# EAGLE schematic car (EAGLE 7.2.0)
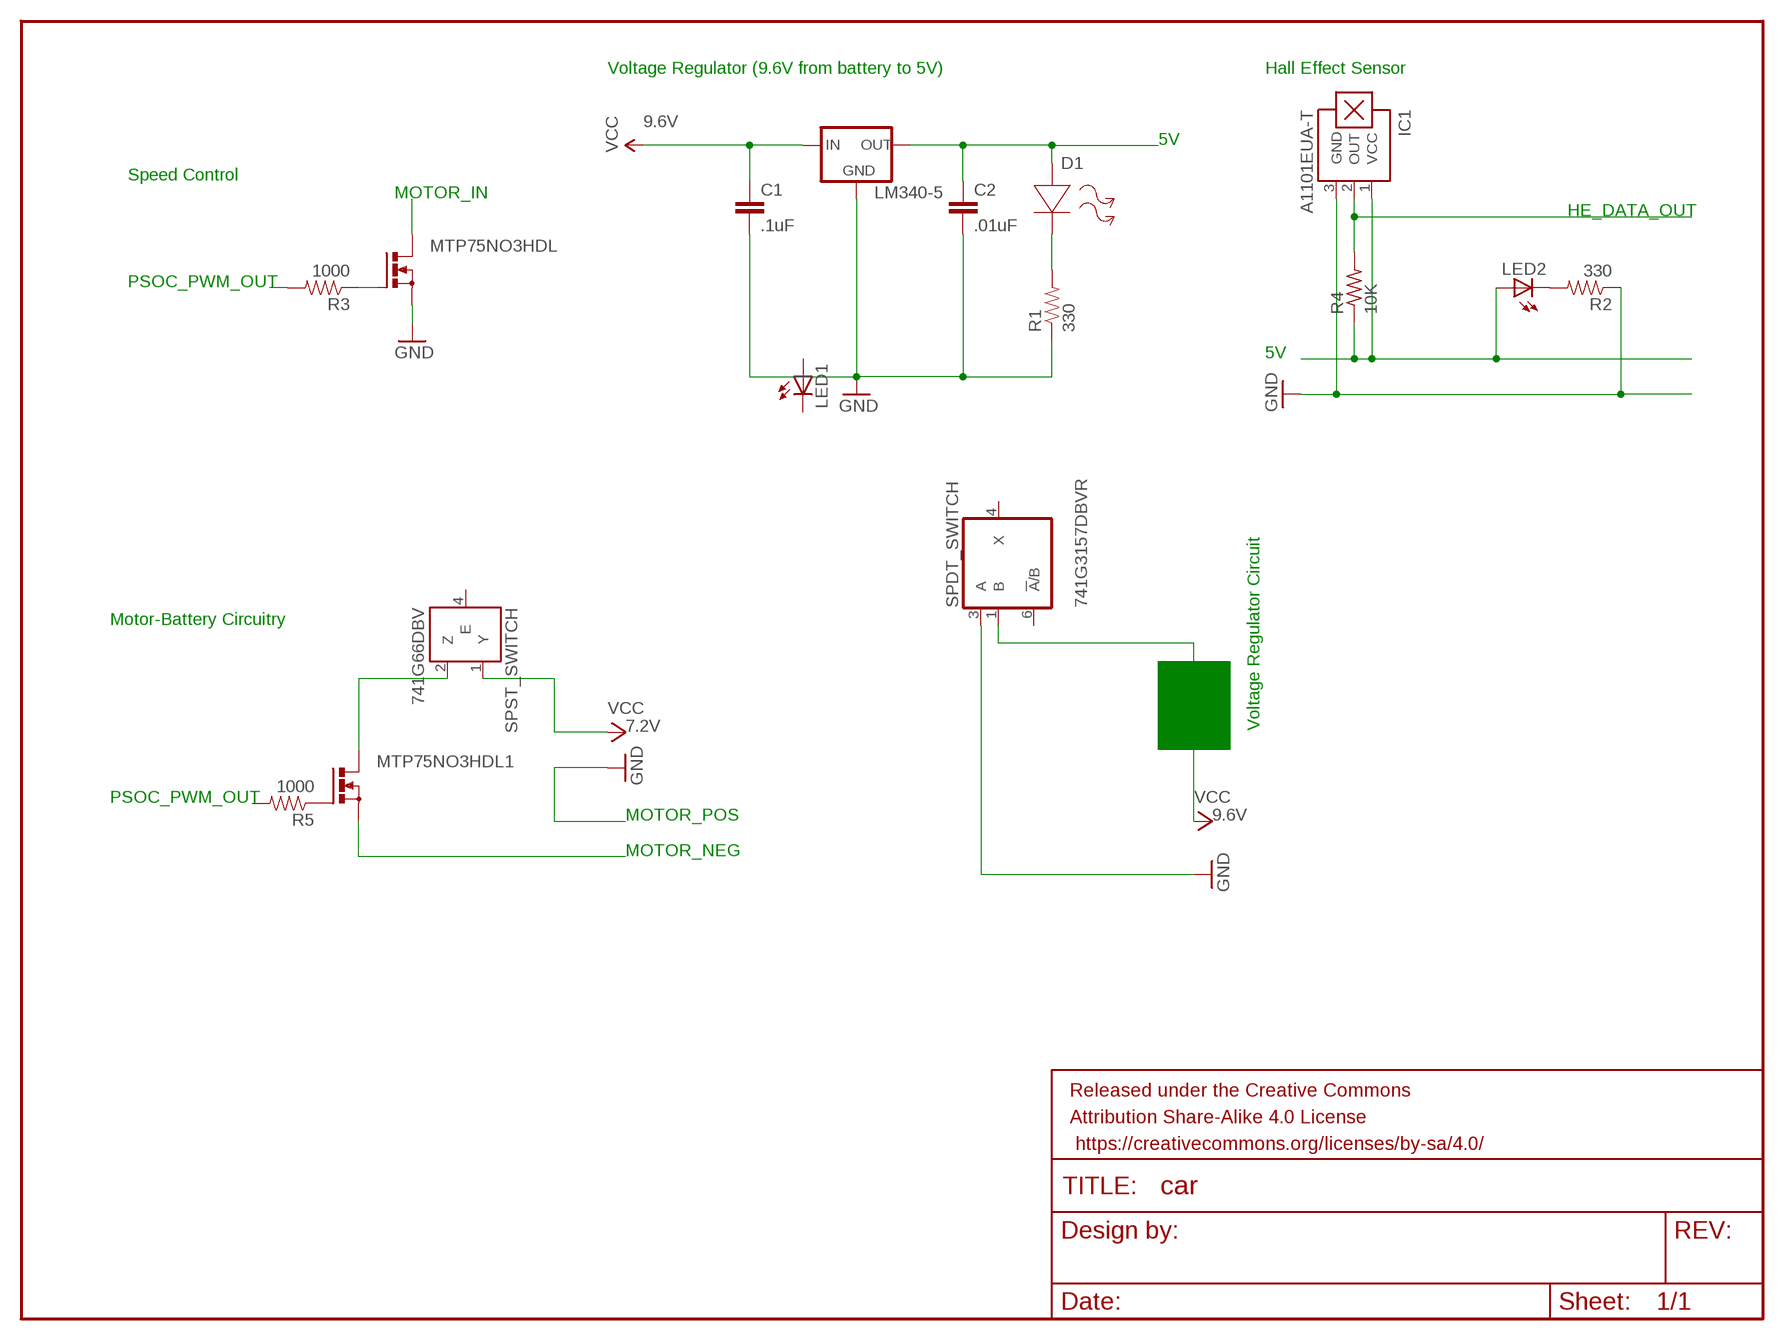
[diagram p0: schematic, sheet 1]

## Parts
C1  .1uF  CAP0402-CAP  [0402-CAP]
C2  .01uF  CAP0402-CAP  [0402-CAP]
D1  LED  [R0805]
FRAME1  FRAME-LETTER  [CREATIVE_COMMONS]
IC1  A1101EUA-T  A1301LH  [SOT23-W]
LED1  LED_E  [LED_1206]
LED2  LED_E  [LED_1206]
LM340-5  V_REG_78XX-TO-220  [TO-220-ALT]
MTP75NO3HDL  PMOSFET_NTO220BH  [TO220BH]
MTP75NO3HDL1  PMOSFET_NTO220BH  [TO220BH]
R1  330  RESISTOR0402-RES  [0402-RES]
R2  330  RESISTOR0402-RES  [0402-RES]
R3  1000  RESISTOR0402-RES  [0402-RES]
R4  10K  R-US_0204/2V  [0204V]
R5  1000  RESISTOR0402-RES  [0402-RES]
SPDT_SWITCH  741G3157DBVR  [DBV_R-PDSO-G6]
SPST_SWITCH  741G66DBV  [SOT23-5]

## Nets
GND: C1.2 C2.2 IC1.3(GND) LM340-5.GND MTP75NO3HDL.S R1.1 R2.1 SPDT_SWITCH.3(A)
N$1: IC1.1(VCC) LED2.A R4.1
N$2: D1.2(-) R1.2
N$3: IC1.2(OUT) R4.2
N$4: C2.1 D1.1(+) LM340-5.OUT
N$5: MTP75NO3HDL.D
N$6: LED2.C R2.2
N$7: MTP75NO3HDL.G R3.1
N$8: R3.2
N$9: MTP75NO3HDL1.D SPST_SWITCH.2(Z)
N$10: MTP75NO3HDL1.S
N$11: MTP75NO3HDL1.G R5.1
N$12: SPDT_SWITCH.1(B)
VCC: C1.1 LM340-5.IN SPST_SWITCH.1(Y)
Unconnected: LED1.A LED1.C R5.2 SPDT_SWITCH.4(X) SPDT_SWITCH.6(!A!/B) SPST_SWITCH.4(E)

## Notes on the sheet
- Voltage Regulator (9.6V from battery to 5V) | Hall Effect Sensor
- 5V
- Speed Control
- MOTOR_IN
- HE_DATA_OUT
- PSOC_PWM_OUT
- 5V
- Voltage Regulator Circuit
- Motor-Battery Circuitry
- PSOC_PWM_OUT
- MOTOR_POS
- MOTOR_NEG

## Power pins joined to a net without a drawn wire
GND: SPDT_SWITCH.2(GND) SPST_SWITCH.3(GND)
VCC: SPDT_SWITCH.5(VCC) SPST_SWITCH.5(VCC)

## Library data of the parts
C1 C2 = SparkFun-Capacitors:CAP: Capacitor Standard 0603 ceramic capacitor, and 0.1" leaded capacitor.
D1 = sym:LED: Light Emitting Diode; SPICEMODEL: NONE; SPICETYPE: diode
FRAME1 = SparkFun-Aesthetics:FRAME-LETTER: Schematic Frame Standard 8.5x11 US Letter frame; DESIGNER: NAME; VERSION: v01
IC1 = allegro:A13*?: Linear Hall Effect Sensor ICs Continuous-Time Ratiometric High-Temperature Operation Programmable Linear with Analog Output A1302 -Replacement- UGN3503 Source: http://www.allegromicro.com/en/Products/Part_Numbers/1301/1301.pdf http://www.allegromicro.com/en/Products/Part_Numbers/1321/1321.pdf http://www.allegromicro.com/en/Products/Part_Numbers/1381/1381.pdf; MF: ALLEGRO MICROSYSTEMS, INC.; MPN: A1301ELHLT-T; OC_FARNELL: 1198084; OC_NEWARK: 31K6634
LED1 LED2 = eagle-ltspice:LED_E: LED Source: http://www.osram.convergy.de Source: www.luxeon.com Source: www.kingbright.com; SPICEMODEL: NONE; SPICEPREFIX: D; SPICETYPE: diode
LM340-5 = SparkFun-PowerIC:V_REG_78XX: Voltage Regulator Standard 78xx regulator. IGO (Input Ground Output). Spark Fun Electronics SKU : COM-00107; PROD_ID: VREG-08450; SF_ID: COM-00107
MTP75NO3HDL MTP75NO3HDL1 = transistor-power:PMOSFET_N: Power MOSFET N-Channel
R1-R3 R5 = SparkFun-Passives:RESISTOR: Resistor Basic schematic elements and footprints for 0603, 1206, and PTH resistors.
R4 = resistor:R-US_: RESISTOR, American symbol
SPDT_SWITCH = 74xx-little-de:74*1G3157: Single-Pole, Double-Throw Analog Switch Source: http://focus.ti.com/lit/ds/symlink/sn74lvc1g3157.pdf
SPST_SWITCH = 74xx-little-de:74*1G66: Single Analog / Bilateral Switch Source: http://www.semiconductors.philips.com/acrobat_download/datasheets/74HC_HCT1G66_3.pdf